# Altium project Dragonflyte.PrjPcb (part 2 of 2)

## Sheet USB.SchDoc
size A; DocumentNumber: 8; SheetNumber: 8
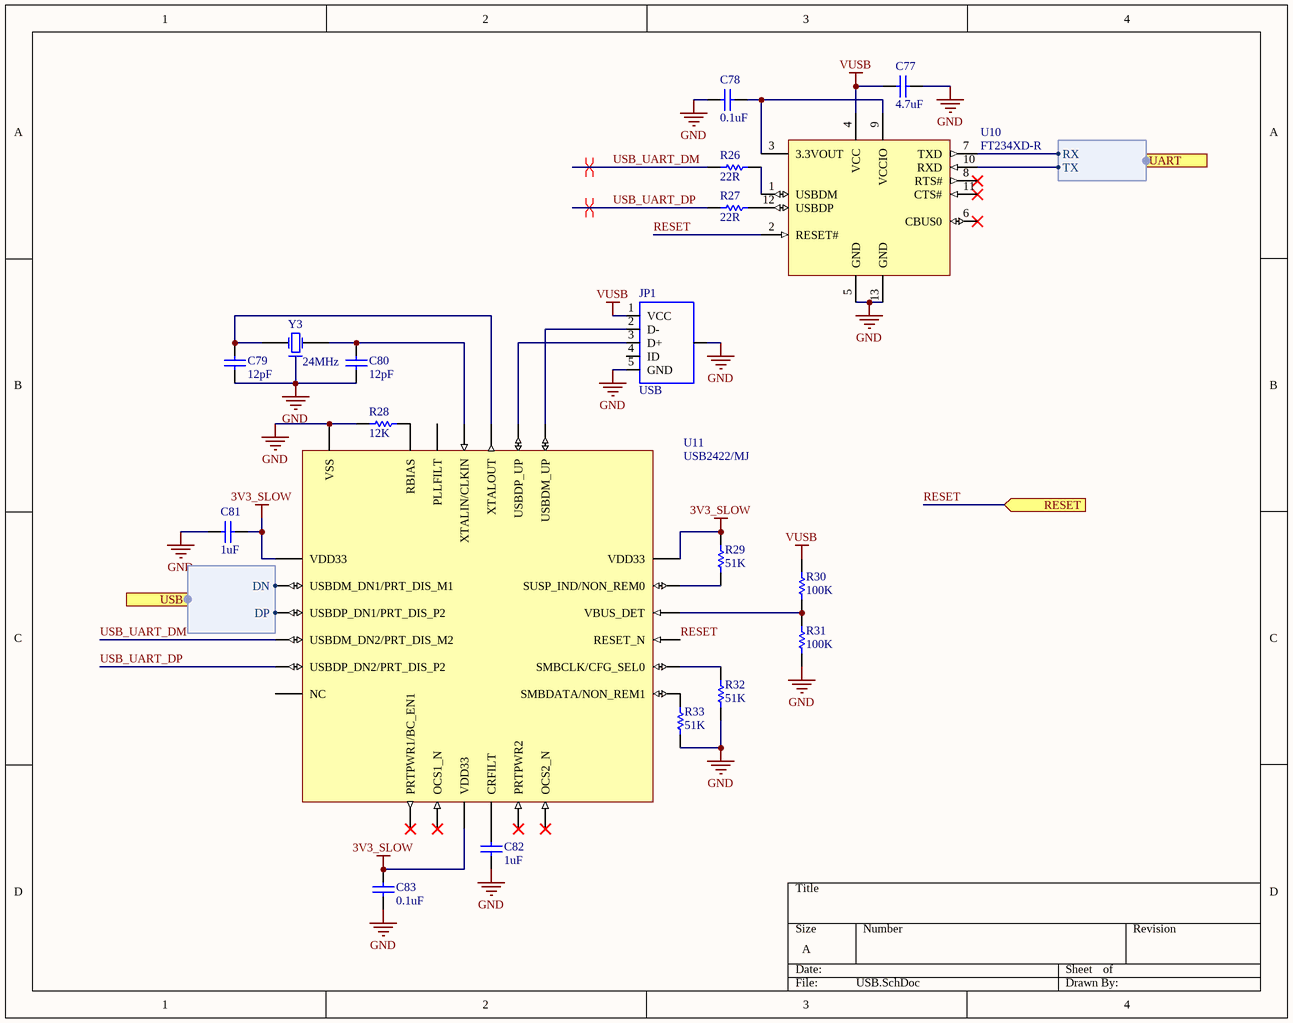
[diagram p6: USB.SchDoc]

### Parts
C77  value 4.7uF  [C0402[1005X55]]  (hidden comment: 4.7uF 6.3V 0402)
C78  value 0.1uF  [C0402[1005X55]]  (hidden comment: 0.1uF 6.3V 0402)
C79  value 12pF  [C0402[1005X55]]  (hidden comment: 12pF 50V 0402)
C80  value 12pF  [C0402[1005X55]]  (hidden comment: 12pF 50V 0402)
C81  value 1uF  [C0402[1005X55]]  (hidden comment: 1uF 6.3V 0402)
C82  value 1uF  [C0402[1005X55]]  (hidden comment: 1uF 6.3V 0402)
C83  value 0.1uF  [C0402[1005X55]]  (hidden comment: 0.1uF 6.3V 0402)
JP1  USB  [USB-MICROB]
R26  value 22R  [R0402[1005]]  (hidden comment: 22R 1% 0402)
R27  value 22R  [R0402[1005]]  (hidden comment: 22R 1% 0402)
R28  value 12K  [R0402[1005]]  (hidden comment: 12K 1% 0402)
R29  value 51K  [R0402[1005]]  (hidden comment: 51K 1% 0402)
R30  value 100K  [R0402[1005]]  (hidden comment: 100K 1% 0402)
R31  value 100K  [R0402[1005]]  (hidden comment: 100K 1% 0402)
R32  value 51K  [R0402[1005]]  (hidden comment: 51K 1% 0402)
R33  value 51K  [R0402[1005]]  (hidden comment: 51K 1% 0402)
U10  FT234XD-R  [DFN-12]
U11  USB2422/MJ  [QFN-24 (4x4MM)]
Y3  24MHz  [CRYSTAL_2.0x1.6]

### Ports
RESET (in), UART (harness UART), USB (harness USB)

### Harnesses
USB: DN, DP
UART: TX, RX

### Nets
3V3_SLOW: C81.2 C83.2 R29.2 U11.1(VDD33) U11.9(VDD33) U11.18(VDD33)
GND: C77.2 C78.2 C79.1 C80.1 C81.1 C82.1 C83.1 JP1.5(GND) JP1.6(SHIELD) R28.1 R31.1 R32.1 R33.1 U10.5(GND) U10.13(GND) U11.25(VSS) Y3.2
VUSB: C77.1 JP1.1(VCC) R30.2 U10.4(VCC)
RESET: U10.2(RESET#) U11.15(RESET_N) ; port RESET
UART_USB_RX: U10.7(TXD) ; port UART.RX
UART_USB_TX: U10.10(RXD) ; port UART.TX
USB_OTG_N: U11.2(USBDM_DN1/PRT_DIS_M1) ; port USB.DN
USB_OTG_P: U11.3(USBDP_DN1/PRT_DIS_P2) ; port USB.DP
USB_UART_DM: R26.1 U11.4(USBDM_DN2/PRT_DIS_M2)
USB_UART_DP: R27.1 U11.5(USBDP_DN2/PRT_DIS_P2)
NetC78_1: C78.1 U10.3(3.3VOUT) U10.9(VCCIO)
NetC79_2: C79.2 U11.21(XTALOUT) Y3.1(X1)
NetC80_2: C80.2 U11.22(XTALIN/CLKIN) Y3.3(X2)
NetC82_2: C82.2 U11.10(CRFILT)
NetJP1_2: JP1.2(D-) U11.19(USBDM_UP)
NetJP1_3: JP1.3(D+) U11.20(USBDP_UP)
NetR26_2: R26.2 U10.1(USBDM)
NetR27_2: R27.2 U10.12(USBDP)
NetR28_2: R28.2 U11.24(RBIAS)
NetR29_1: R29.1 U11.17(SUSP_IND/NON_REM0)
NetR30_1: R30.1 R31.2 U11.16(VBUS_DET)
NetR32_2: R32.2 U11.14(SMBCLK/CFG_SEL0)
NetR33_2: R33.2 U11.13(SMBDATA/NON_REM1)

Not connected (* = marked no-connect by the designer): JP1 4(ID); U10 6(CBUS0)* 8(RTS#)* 11(CTS#)*; U11 6(NC) 7(PRTPWR1/BC_EN1)* 8(OCS1_N)* 11(PRTPWR2)* 12(OCS2_N)* 23(PLLFILT)

### Layout directives
differential pair: USB_UART_DM, USB_UART_DP

### Library data of the parts
C77 = CAP_4.7uF_6.3V_0402_20%: as C29 on sheet MPU-Peripherals; Mounting Technology: Surface Mount; PackageReference: 0402; PackageDescription: 0402 (1005 Metric); Voltage: 6.3V; Tolerance: 20%
C78 C83 = CAP_0.1uF_6.3V_0402_10%: as C68 on sheet Supplies; Mounting Technology: Surface Mount; PackageReference: 0402; PackageDescription: 0402 (1005 Metric); Voltage: 6.3V; Tolerance: 10%
C79 C80 = CAP_12pF_50V_0402_5%: 12pF 50V 5% 0402 (1005 Metric); PartNumber: GRM1555C1H120JA01D; Manufacturer: Murata; Mounting Technology: Surface Mount; PackageReference: 0402; PackageDescription: 0402 (1005 Metric); Voltage: 50V; Tolerance: 5%
C81 C82 = CAP_1uF_6.3V_0402_10%: 1uF 6.3V 10% 0402 (1005 Metric); PartNumber: GRM155R70J105KA12D; Manufacturer: Murata; Mounting Technology: Surface Mount; PackageReference: 0402; PackageDescription: 0402 (1005 Metric); Voltage: 6.3V; Tolerance: 10%
JP1 = USB_MICROB_SMT: pin to pad: 1>VBUS 2>D- 3>D+ 4>ID 5>GND 6>MT1+P$1+P$2+MT2; PartNumber: 10118192-0001LF; Manufacturer: Amphenol FCI; Mounting Technology: Surface Mount; PackageReference: USB - Micro B
R26 R27 = RES_22R_0402_1%: 22R 0.063W 1% 0402 (1005 Metric); Manufacturer: KOA Speer; PartNumber: RK73H1ETTP22R0F; Tolerance: 1%; Power: 0.063W; Mounting Technology: Surface Mount; PackageReference: 0402; PackageDescription: 0402 (1005 Metric); ComponentLink1Description: Datasheet; ComponentLink1URL: http://www.koaspeer.com/catimages/Products/RK73H/RK73H.pdf
R28 = RES_12K_0402_1%: 12K 0.063W 1% 0402 (1005 Metric); Manufacturer: KOA Speer; PartNumber: RK73H1ETTP1202F; Tolerance: 1%; Power: 0.063W; Mounting Technology: Surface Mount; PackageReference: 0402; PackageDescription: 0402 (1005 Metric); ComponentLink1Description: Datasheet; ComponentLink1URL: http://www.koaspeer.com/catimages/Products/RK73H/RK73H.pdf
R29 R32 R33 = RES_51K_0402_1%: 51K 0.063W 1% 0402 (1005 Metric); Manufacturer: KOA Speer; PartNumber: RK73H1ETTP5102F; Tolerance: 1%; Power: 0.063W; Mounting Technology: Surface Mount; PackageReference: 0402; PackageDescription: 0402 (1005 Metric); ComponentLink1Description: Datasheet; ComponentLink1URL: http://www.koaspeer.com/catimages/Products/RK73H/RK73H.pdf
R30 R31 = RES_100K_0402_1%: 100K 0.063W 1% 0402 (1005 Metric); Manufacturer: KOA Speer; PartNumber: RK73H1ETTP1003F; Tolerance: 1%; Power: 0.063W; Mounting Technology: Surface Mount; PackageReference: 0402; PackageDescription: 0402 (1005 Metric); ComponentLink1Description: Datasheet; ComponentLink1URL: http://www.koaspeer.com/catimages/Products/RK73H/RK73H.pdf
U10 = FT234XD-R: USB Interface IC USB to Serial UART Interface; Manufacturer: FTDI; PartNumber: FT234XD-R; PackageReference: DFN-12; Mounting Technology: Surface Mount
U11 = USB2422/MJ: USB Hub IC 2-Port; Manufacturer: Microchip; PartNumber: USB2422/MJ; PackageReference: QFN-24; Mounting Technology: Surface Mount
Y3 = FA-128 24.0000MF10Z-W3: Manufacturer: EPSON; PartNumber: FA-128 24.0000MF10Z-W3; Mounting Technology: Surface Mount; PackageReference: 4-SMD

## Sheet Sensors.SchDoc
size A; DocumentNumber: 11; SheetNumber: 11
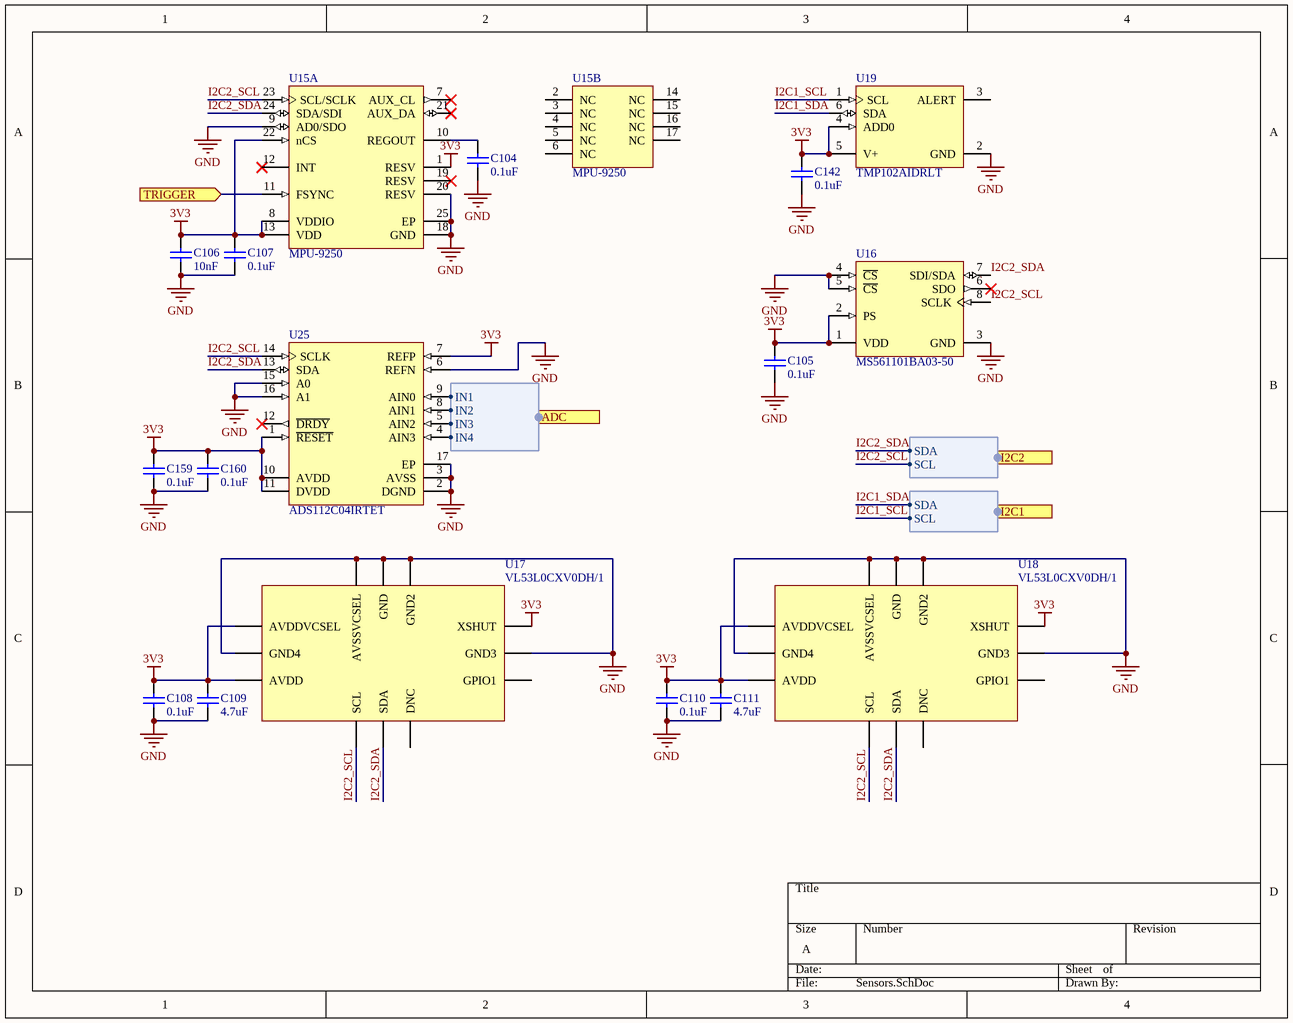
[diagram p7: Sensors.SchDoc]

### Parts
C104  value 0.1uF  [C0402[1005X55]]  (hidden comment: 0.1uF 6.3V 0402)
C105  value 0.1uF  [C0402[1005X55]]  (hidden comment: 0.1uF 6.3V 0402)
C106  value 10nF  [C0402[1005X55]]  (hidden comment: 10nF 50V 0402)
C107  value 0.1uF  [C0402[1005X55]]  (hidden comment: 0.1uF 6.3V 0402)
C108  value 0.1uF  [C0402[1005X55]]  (hidden comment: 0.1uF 6.3V 0402)
C109  value 4.7uF  [C0402[1005X55]]  (hidden comment: 4.7uF 6.3V 0402)
C110  value 0.1uF  [C0402[1005X55]]  (hidden comment: 0.1uF 6.3V 0402)
C111  value 4.7uF  [C0402[1005X55]]  (hidden comment: 4.7uF 6.3V 0402)
C142  value 0.1uF  [C0402[1005X55]]  (hidden comment: 0.1uF 6.3V 0402)
C159  value 0.1uF  [C0402[1005X55]]  (hidden comment: 0.1uF 6.3V 0402)
C160  value 0.1uF  [C0402[1005X55]]  (hidden comment: 0.1uF 6.3V 0402)
U15  MPU-9250  [QFN-24 (0.4MM)]  (parts A,B of 2)
U16  MS561101BA03-50  [QFN-8 (5x3MM)]
U17  VL53L0CXV0DH/1  [LGA-12]
U18  VL53L0CXV0DH/1  [LGA-12]
U19  TMP102AIDRLT  [SOT-563]
U25  ADS112C04IRTET  [QFN-16]

### Ports
ADC (harness ADC), I2C1 (harness I2C), I2C2 (harness I2C), TRIGGER (in)

### Harnesses
I2C: SCL, SDA
ADC: IN3, IN2, IN1, IN4

### Nets
3V3: C105.2 C106.2 C107.2 C108.2 C109.2 C110.2 C111.2 C142.2 C159.2 C160.2 U15.1(RESV) U15.8(VDDIO) U15.13(VDD) U15.22(nCS) U16.1(VDD) U16.2(PS) U17.1(AVDDVCSEL) U17.5(XSHUT) U17.11(AVDD) U18.1(AVDDVCSEL) U18.5(XSHUT) U18.11(AVDD) U19.4(ADD0) U19.5(V+) U25.1(~{RESET}) U25.7(REFP) U25.10(AVDD) U25.11(DVDD)
GND: C104.1 C105.1 C106.1 C107.1 C108.1 C109.1 C110.1 C111.1 C142.1 C159.1 C160.1 U15.9(AD0/SDO) U15.18(GND) U15.20(RESV) U15.25(EP) U16.3(GND) U16.4(~{CS}) U16.5(~{CS}) U17.2(AVSSVCSEL) U17.3(GND) U17.4(GND2) U17.6(GND3) U17.12(GND4) U18.2(AVSSVCSEL) U18.3(GND) U18.4(GND2) U18.6(GND3) U18.12(GND4) U19.2(GND) U25.2(DGND) U25.3(AVSS) U25.6(REFN) U25.15(A0) U25.16(A1) U25.17(EP)
I2C1_SCL: U19.1(SCL) ; port I2C1.SCL
I2C1_SDA: U19.6(SDA) ; port I2C1.SDA
I2C2_SCL: U15.23(SCL/SCLK) U16.8(SCLK) U17.10(SCL) U18.10(SCL) U25.14(SCLK) ; port I2C2.SCL
I2C2_SDA: U15.24(SDA/SDI) U16.7(SDI/SDA) U17.9(SDA) U18.9(SDA) U25.13(SDA) ; port I2C2.SDA
TRIGGER: U15.11(FSYNC) ; port TRIGGER
NetC104_2: C104.2 U15.10(REGOUT)
NetJP3_2: U25.4(AIN3) ; port ADC.IN4
NetJP3_3: U25.5(AIN2) ; port ADC.IN3
NetJP3_4: U25.8(AIN1) ; port ADC.IN2
NetJP3_5: U25.9(AIN0) ; port ADC.IN1

Not connected (* = marked no-connect by the designer): U15 2(NC) 3(NC) 4(NC) 5(NC) 6(NC) 7(AUX_CL)* 12(INT)* 14(NC) 15(NC) 16(NC) 17(NC) 19(RESV)* 21(AUX_DA)*; U16 6(SDO)*; U17 7(GPIO1) 8(DNC); U18 7(GPIO1) 8(DNC); U19 3(ALERT); U25 12(~{DRDY})*

### Library data of the parts
C104 C105 C107 C108 C110 C142 C159 C160 = CAP_0.1uF_6.3V_0402_10%: as C68 on sheet Supplies; Mounting Technology: Surface Mount; PackageReference: 0402; PackageDescription: 0402 (1005 Metric); Voltage: 6.3V; Tolerance: 10%
C106 = CAP_10nF_50V_0402_10%: 10nF 50V 10% 0402 (1005 Metric); PartNumber: GCM155R71H103KA55D; Manufacturer: Murata; Mounting Technology: Surface Mount; PackageReference: 0402; PackageDescription: 0402 (1005 Metric); Voltage: 50V; Tolerance: 10%
C109 C111 = CAP_4.7uF_6.3V_0402_20%: as C29 on sheet MPU-Peripherals; Mounting Technology: Surface Mount; PackageReference: 0402; PackageDescription: 0402 (1005 Metric); Voltage: 6.3V; Tolerance: 20%
U15 = MPU-9250: Manufacturer: Invensense; PartNumber: MPU-9250; Mounting Technology: Surface Mount; PackageReference: QFN-24
U16 = MS561101BA03-50: BAROMETRIC PRESSURE SENSOR; Manufacturer: TE Connectivity Measurement Specialties; PartNumber: MS561101BA03-50; PackageReference: 8-SMD; Mounting Technology: Surface Mount
U17 U18 = VL53L0CXV0DH/1: Optical Sensor Modules Time-of-Flight (ToF) ranging sensor; Manufacturer: STMicroelectronics; PartNumber: VL53L0CXV0DH/1; Mounting Technology: Surface Mount; PackageReference: LGA-12
U19 = TMP102AIDRLT: SENSOR DIGITAL -40C-125C SOT563; Manufacturer: Texas Instruments; PackageReference: SOT-563; PartNumber: TMP102AIDRLT; Mounting Technology: Surface Mount
U25 = ADS112C04IRTET: IC ADC 16BIT I2C 1KSPS 16WQFN; Manufacturer: Texas Instruments; PackageReference: QFN-16; Mounting Technology: Surface Mount; PartNumber: ADS112C04IRTET

## Sheet UWB.SchDoc
size A; DocumentNumber: 10; SheetNumber: 10
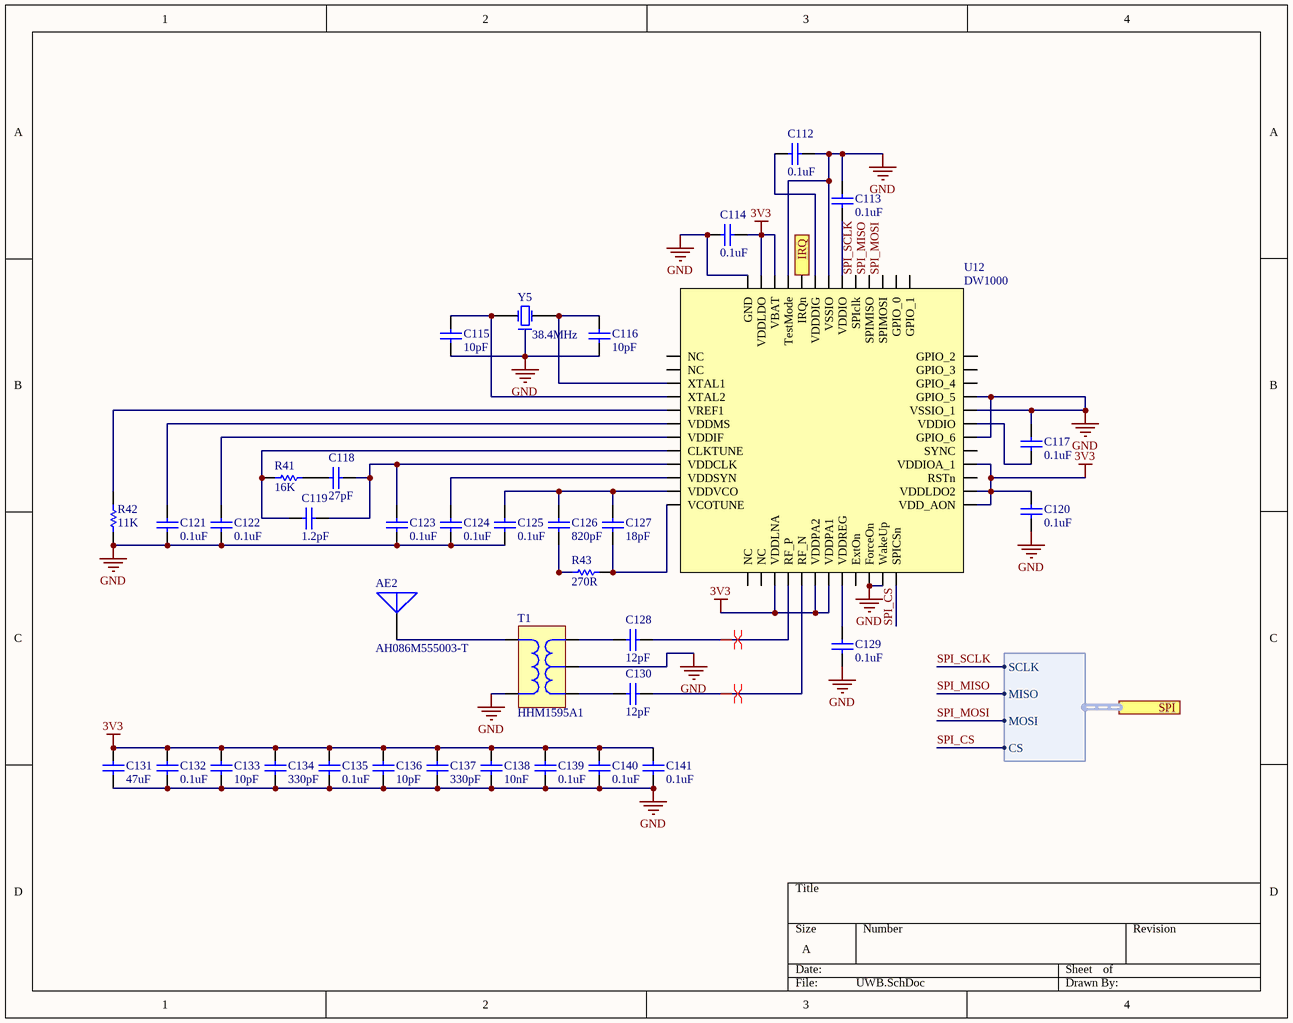
[diagram p8: UWB.SchDoc]

### Parts
AE2  AH086M555003-T  [AH086M555003-T]
C112  value 0.1uF  [C0402[1005X55]]  (hidden comment: 0.1uF 6.3V 0402)
C113  value 0.1uF  [C0402[1005X55]]  (hidden comment: 0.1uF 6.3V 0402)
C114  value 0.1uF  [C0402[1005X55]]  (hidden comment: 0.1uF 6.3V 0402)
C115  value 10pF  [C0402[1005X55]]  (hidden comment: 10pF 50V 0402)
C116  value 10pF  [C0402[1005X55]]  (hidden comment: 10pF 50V 0402)
C117  value 0.1uF  [C0402[1005X55]]  (hidden comment: 0.1uF 6.3V 0402)
C118  value 27pF  [C0402[1005X55]]  (hidden comment: 27pF 50V 0402)
C119  value 1.2pF  [C0402[1005X55]]  (hidden comment: 1.2pF 50V 0402)
C120  value 0.1uF  [C0402[1005X55]]  (hidden comment: 0.1uF 6.3V 0402)
C121  value 0.1uF  [C0402[1005X55]]  (hidden comment: 0.1uF 6.3V 0402)
C122  value 0.1uF  [C0402[1005X55]]  (hidden comment: 0.1uF 6.3V 0402)
C123  value 0.1uF  [C0402[1005X55]]  (hidden comment: 0.1uF 6.3V 0402)
C124  value 0.1uF  [C0402[1005X55]]  (hidden comment: 0.1uF 6.3V 0402)
C125  value 0.1uF  [C0402[1005X55]]  (hidden comment: 0.1uF 6.3V 0402)
C126  value 820pF  [C0402[1005X55]]  (hidden comment: 820pF 50V 0402)
C127  value 18pF  [C0402[1005X55]]  (hidden comment: 18pF 50V 0402)
C128  value 12pF  [C0402[1005X55]]  (hidden comment: 12pF 50V 0402)
C129  value 0.1uF  [C0402[1005X55]]  (hidden comment: 0.1uF 6.3V 0402)
C130  value 12pF  [C0402[1005X55]]  (hidden comment: 12pF 50V 0402)
C131  value 47uF  [C1206[3216X160]]  (hidden comment: 47uF 6.3V 1206)
C132  value 0.1uF  [C0402[1005X55]]  (hidden comment: 0.1uF 6.3V 0402)
C133  value 10pF  [C0402[1005X55]]  (hidden comment: 10pF 50V 0402)
C134  value 330pF  [C0402[1005X55]]  (hidden comment: 330pF 50V 0402)
C135  value 0.1uF  [C0402[1005X55]]  (hidden comment: 0.1uF 6.3V 0402)
C136  value 10pF  [C0402[1005X55]]  (hidden comment: 10pF 50V 0402)
C137  value 330pF  [C0402[1005X55]]  (hidden comment: 330pF 50V 0402)
C138  value 10nF  [C0402[1005X55]]  (hidden comment: 10nF 50V 0402)
C139  value 0.1uF  [C0402[1005X55]]  (hidden comment: 0.1uF 6.3V 0402)
C140  value 0.1uF  [C0402[1005X55]]  (hidden comment: 0.1uF 6.3V 0402)
C141  value 0.1uF  [C0402[1005X55]]  (hidden comment: 0.1uF 6.3V 0402)
R41  value 16K  [R0402[1005]]  (hidden comment: 16K 1% 0402)
R42  value 11K  [R0402[1005]]  (hidden comment: 11K 1% 0402)
R43  value 270R  [R0402[1005]]  (hidden comment: 270R 1% 0402)
T1  HHM1595A1  [HHM1595A1]
U12  DW1000  [QFN-48]
Y5  38.4MHz  [ABRA-ABM10]

### Ports
IRQ (out), SPI (harness SPI)

### Harnesses
SPI: SCLK, MISO, MOSI, CS

### Nets
3V3: C114.1 C120.2 C131.2 C132.2 C133.2 C134.2 C135.2 C136.2 C137.2 C138.2 C139.2 C140.2 C141.2 U12.15(VDDLNA) U12.18(VDDPA2) U12.19(VDDPA1) U12.25(VDD_AON) U12.26(VDDLDO2) U12.28(VDDIOA_1) U12.47(VBAT) U12.48(VDDLDO)
GND: C112.1 C113.2 C114.2 C115.1 C116.1 C117.2 C120.1 C121.1 C122.1 C123.1 C124.1 C125.1 C129.1 C131.1 C132.1 C133.1 C134.1 C135.1 C136.1 C137.1 C138.1 C139.1 C140.1 C141.1 R42.1 T1.2 T1.5 U12.22(ForceOn) U12.23(WakeUp) U12.30(GPIO_6) U12.32(VSSIO_1) U12.33(GPIO_5) U12.43(VSSIO) U12.46(TestMode) U12.49(GND) Y5.2
SPI_CS: U12.24(SPICSn) ; port SPI.CS
SPI_MISO: U12.40(SPIMISO) ; port SPI.MISO
SPI_MOSI: U12.39(SPIMOSI) ; port SPI.MOSI
SPI_SCLK: U12.41(SPIclk) ; port SPI.SCLK
NetAE2_1: AE2.1 T1.1
NetC112_2: C112.2 U12.44(VDDDIG)
NetC113_1: C113.1 U12.42(VDDIO)
NetC115_2: C115.2 U12.4(XTAL2) Y5.1(X1)
NetC116_2: C116.2 U12.3(XTAL1) Y5.3(X2)
NetC117_1: C117.1 U12.31(VDDIO)
NetC118_1: C118.1 C119.1 C123.2 U12.9(VDDCLK)
NetC118_2: C118.2 R41.1
NetC119_2: C119.2 R41.2 U12.8(CLKTUNE)
NetC121_2: C121.2 U12.6(VDDMS)
NetC122_2: C122.2 U12.7(VDDIF)
NetC124_2: C124.2 U12.10(VDDSYN)
NetC125_2: C125.2 C126.2 C127.2 U12.11(VDDVCO)
NetC126_1: C126.1 R43.1
NetC127_1: C127.1 R43.2 U12.12(VCOTUNE)
NetC128_1: C128.1 T1.4
NetC128_2: C128.2 U12.16(RF_P)
NetC129_2: C129.2 U12.20(VDDREG)
NetC130_1: C130.1 T1.3
NetC130_2: C130.2 U12.17(RF_N)
NetR42_2: R42.2 U12.5(VREF1)
NetU1_A16: U12.45(IRQn) ; port IRQ

Not connected (* = marked no-connect by the designer): U12 1(NC) 2(NC) 13(NC) 14(NC) 21(ExtOn) 27(RSTn) 29(SYNC) 34(GPIO_4) 35(GPIO_3) 36(GPIO_2) 37(GPIO_1) 38(GPIO_0)

### Layout directives
differential pair: NetC128_2, NetC130_2

### Library data of the parts
AE2 = AH086M555003-T: Manufacturer: Taiyo Yuden; PartNumber: AH086M555003-T; Mounting Technology: Surface Mount
C112-C114 C117 C120-C125 C129 C132 C135 C139-C141 = CAP_0.1uF_6.3V_0402_10%: as C68 on sheet Supplies; Mounting Technology: Surface Mount; PackageReference: 0402; PackageDescription: 0402 (1005 Metric); Voltage: 6.3V; Tolerance: 10%
C115 C116 C133 C136 = CAP_10pF_50V_0402_1%: 10pF 50V 1% 0402 (1005 Metric); PartNumber: GRM1555C1H100FA01D; Manufacturer: Murata; Mounting Technology: Surface Mount; PackageReference: 0402; PackageDescription: 0402 (1005 Metric); Voltage: 50V; Tolerance: 1%
C118 = CAP_27pF_50V_0402_1%: 27pF 50V 1% 0402 (1005 Metric); PartNumber: GRM1555C1H270FA01D; Manufacturer: Murata; Mounting Technology: Surface Mount; PackageReference: 0402; PackageDescription: 0402 (1005 Metric); Voltage: 50V; Tolerance: 1%
C119 = CAP_1.2pF_50V_0402_0.05pF: 1.2pF 50V 0.05pF 0402 (1005 Metric); PartNumber: GRM1555C1H1R2WA01D; Manufacturer: Murata; Mounting Technology: Surface Mount; PackageReference: 0402; PackageDescription: 0402 (1005 Metric); Voltage: 50V; Tolerance: 0.05pF
C126 = CAP_820pF_50V_0402_5%: 820pF 50V 5% 0402 (1005 Metric); PartNumber: GRM1555C1H821JA01D; Manufacturer: Murata; Mounting Technology: Surface Mount; PackageReference: 0402; PackageDescription: 0402 (1005 Metric); Voltage: 50V; Tolerance: 5%
C127 = CAP_18pF_50V_0402_1%: 18pF 50V 1% 0402 (1005 Metric); PartNumber: GRM1555C1H180FA01D; Manufacturer: Murata; Mounting Technology: Surface Mount; PackageReference: 0402; PackageDescription: 0402 (1005 Metric); Voltage: 50V; Tolerance: 1%
C128 C130 = CAP_12pF_50V_0402_5%: as C79 on sheet USB; Mounting Technology: Surface Mount; PackageReference: 0402; PackageDescription: 0402 (1005 Metric); Voltage: 50V; Tolerance: 5%
C131 = CAP_47uF_6.3V_1206_10%: 47uF 6.3V 10% 1206 (3216 Metric); PartNumber: GRM31CR60J476KE19L; Manufacturer: Murata; Mounting Technology: Surface Mount; PackageReference: 1206; PackageDescription: 1206 (3216 Metric); Voltage: 6.3V; Tolerance: 10%
C134 C137 = CAP_330pF_50V_0402_5%: 330pF 50V 5% 0402 (1005 Metric); PartNumber: GRM1555C1H331JA01D; Manufacturer: Murata; Mounting Technology: Surface Mount; PackageReference: 0402; PackageDescription: 0402 (1005 Metric); Voltage: 50V; Tolerance: 5%
C138 = CAP_10nF_50V_0402_10%: as C106 on sheet Sensors; Mounting Technology: Surface Mount; PackageReference: 0402; PackageDescription: 0402 (1005 Metric); Voltage: 50V; Tolerance: 10%
R41 = RES_16K_0402_1%: 16K 0.063W 1% 0402 (1005 Metric); Manufacturer: KOA Speer; PartNumber: RK73H1ETTP1602F; Tolerance: 1%; Power: 0.063W; Mounting Technology: Surface Mount; PackageReference: 0402; PackageDescription: 0402 (1005 Metric); ComponentLink1Description: Datasheet; ComponentLink1URL: http://www.koaspeer.com/catimages/Products/RK73H/RK73H.pdf
R42 = RES_11K_0402_1%: 11K 0.063W 1% 0402 (1005 Metric); Manufacturer: KOA Speer; PartNumber: RK73H1ETTP1102F; Tolerance: 1%; Power: 0.063W; Mounting Technology: Surface Mount; PackageReference: 0402; PackageDescription: 0402 (1005 Metric); ComponentLink1Description: Datasheet; ComponentLink1URL: http://www.koaspeer.com/catimages/Products/RK73H/RK73H.pdf
R43 = RES_270R_0402_1%: 270R 0.063W 1% 0402 (1005 Metric); Manufacturer: KOA Speer; PartNumber: RK73H1ETTP2700F; Tolerance: 1%; Power: 0.063W; Mounting Technology: Surface Mount; PackageReference: 0402; PackageDescription: 0402 (1005 Metric); ComponentLink1Description: Datasheet; ComponentLink1URL: http://www.koaspeer.com/catimages/Products/RK73H/RK73H.pdf
T1 = HHM1595A1: Manufacturer: TDK; PartNumber: HHM1595A1; PackageReference: 0805; Mounting Technology: Surface Mount
U12 = DW1000: UWB DW1000; PartNumber: DW1000-I-TR13; Manufacturer: Decawave Limited; PackageReference: QFN-48; Mounting Technology: Surface Mount
Y5 = ABM10-165-38.400MHZ-T3: Manufacturer: ABRACON; PartNumber: ABM10-165-38.400MHZ-T3; Mounting Technology: Surface Mount; PackageReference: 4-SMD; PackageDescription: 4-SMD, No Lead (DFN, LCC)

## Sheet MicrophoneArray.SchDoc
size A; DocumentNumber: 13; SheetNumber: 13
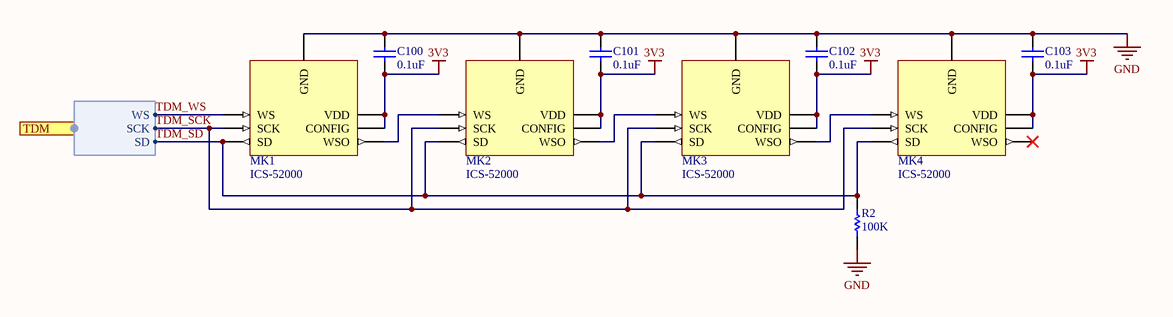
[diagram p9: MicrophoneArray.SchDoc]

### Parts
C100  value 0.1uF  [C0402[1005X55]]  (hidden comment: 0.1uF 6.3V 0402)
C101  value 0.1uF  [C0402[1005X55]]  (hidden comment: 0.1uF 6.3V 0402)
C102  value 0.1uF  [C0402[1005X55]]  (hidden comment: 0.1uF 6.3V 0402)
C103  value 0.1uF  [C0402[1005X55]]  (hidden comment: 0.1uF 6.3V 0402)
MK1  ICS-52000  [MIC]
MK2  ICS-52000  [MIC]
MK3  ICS-52000  [MIC]
MK4  ICS-52000  [MIC]
R2  value 100K  [R0402[1005]]  (hidden comment: 100K 1% 0402)

### Ports
TDM (harness TDM)

### Harnesses
TDM: WS, SCK, SD

### Nets
3V3: C100.1 C101.1 C102.1 C103.1 MK1.2(CONFIG) MK1.3(VDD) MK2.2(CONFIG) MK2.3(VDD) MK3.2(CONFIG) MK3.3(VDD) MK4.2(CONFIG) MK4.3(VDD)
GND: C100.2 C101.2 C102.2 C103.2 MK1.4(GND) MK2.4(GND) MK3.4(GND) MK4.4(GND) R2.1
TDM_SCK: MK1.6(SCK) MK2.6(SCK) MK3.6(SCK) MK4.6(SCK) ; port TDM.SCK
TDM_SD: MK1.7(SD) MK2.7(SD) MK3.7(SD) MK4.7(SD) R2.2 ; port TDM.SD
TDM_WS: MK1.5(WS) ; port TDM.WS
NetMK1_1: MK1.1(WSO) MK2.5(WS)
NetMK2_1: MK2.1(WSO) MK3.5(WS)
NetMK3_1: MK3.1(WSO) MK4.5(WS)

Not connected (* = marked no-connect by the designer): MK4 1(WSO)*

### Library data of the parts
C100-C103 = CAP_0.1uF_6.3V_0402_10%: as C68 on sheet Supplies; Mounting Technology: Surface Mount; PackageReference: 0402; PackageDescription: 0402 (1005 Metric); Voltage: 6.3V; Tolerance: 10%
MK1-MK4 = ICS-52000: MIC MEMS DIGITAL OMNI -26DB; Manufacturer: TDK InvenSense; PartNumber: ICS-52000; Mounting Technology: Surface Mount
R2 = RES_100K_0402_1%: as R30 on sheet USB; Tolerance: 1%; Power: 0.063W; Mounting Technology: Surface Mount; PackageReference: 0402; PackageDescription: 0402 (1005 Metric); ComponentLink1Description: Datasheet; ComponentLink1URL: http://www.koaspeer.com/catimages/Products/RK73H/RK73H.pdf

## Sheet Cameras.SchDoc
size B; DocumentNumber: 9; SheetNumber: 9
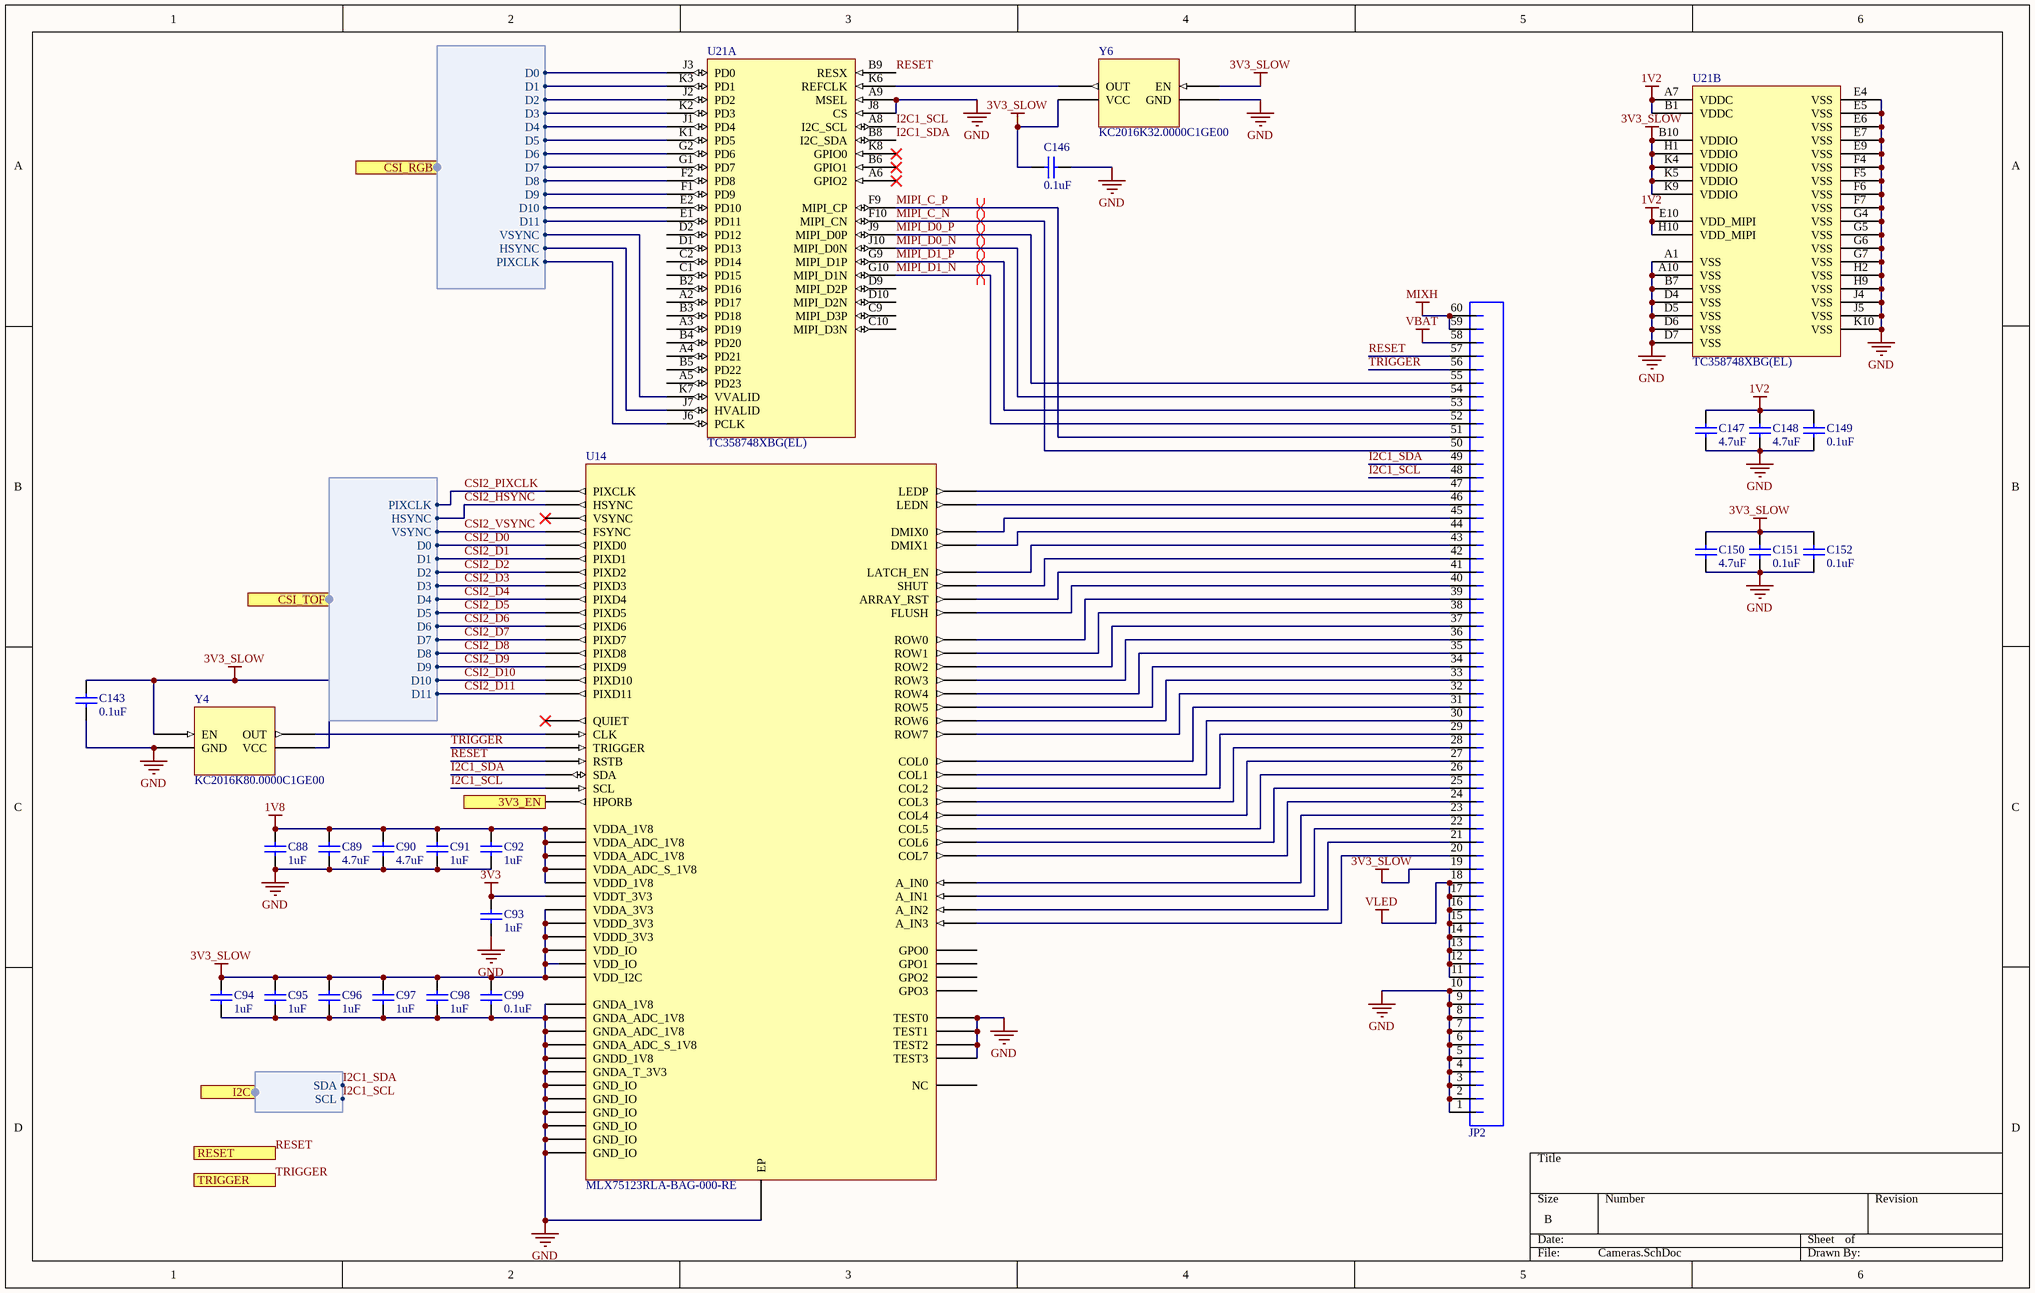
[diagram p10: Cameras.SchDoc]

### Parts
C88  value 1uF  [C0402[1005X55]]  (hidden comment: 1uF 6.3V 0402)
C89  value 4.7uF  [C0402[1005X55]]  (hidden comment: 4.7uF 6.3V 0402)
C90  value 4.7uF  [C0402[1005X55]]  (hidden comment: 4.7uF 6.3V 0402)
C91  value 1uF  [C0402[1005X55]]  (hidden comment: 1uF 6.3V 0402)
C92  value 1uF  [C0402[1005X55]]  (hidden comment: 1uF 6.3V 0402)
C93  value 1uF  [C0402[1005X55]]  (hidden comment: 1uF 6.3V 0402)
C94  value 1uF  [C0402[1005X55]]  (hidden comment: 1uF 6.3V 0402)
C95  value 1uF  [C0402[1005X55]]  (hidden comment: 1uF 6.3V 0402)
C96  value 1uF  [C0402[1005X55]]  (hidden comment: 1uF 6.3V 0402)
C97  value 1uF  [C0402[1005X55]]  (hidden comment: 1uF 6.3V 0402)
C98  value 1uF  [C0402[1005X55]]  (hidden comment: 1uF 6.3V 0402)
C99  value 0.1uF  [C0402[1005X55]]  (hidden comment: 0.1uF 6.3V 0402)
C143  value 0.1uF  [C0402[1005X55]]  (hidden comment: 0.1uF 6.3V 0402)
C146  value 0.1uF  [C0402[1005X55]]  (hidden comment: 0.1uF 6.3V 0402)
C147  value 4.7uF  [C0402[1005X55]]  (hidden comment: 4.7uF 6.3V 0402)
C148  value 4.7uF  [C0402[1005X55]]  (hidden comment: 4.7uF 6.3V 0402)
C149  value 0.1uF  [C0402[1005X55]]  (hidden comment: 0.1uF 6.3V 0402)
C150  value 4.7uF  [C0402[1005X55]]  (hidden comment: 4.7uF 6.3V 0402)
C151  value 0.1uF  [C0402[1005X55]]  (hidden comment: 0.1uF 6.3V 0402)
C152  value 0.1uF  [C0402[1005X55]]  (hidden comment: 0.1uF 6.3V 0402)
JP2  JST_JMD_60_HORZ  [JST-JMD-60-SMD-HORZ]  (value not drawn)
U14  MLX75123RLA-BAG-000-RE  [AQFN-84]
U21  TC358748XBG(EL)  [BGA-80]  (parts A,B of 2)
Y4  KC2016K80.0000C1GE00  [KC2016K]
Y6  KC2016K32.0000C1GE00  [KC2016K]

### Ports
3V3_EN (out), CSI_RGB (harness CSI12), CSI_TOF (harness CSI12), I2C (harness I2C), RESET (in), TRIGGER (in)

### Harnesses
CSI12: D2, D3, D1, D0, D6, D7, D5, D4, D10, D9, D8, PIXCLK, D11, HSYNC, VSYNC
I2C: SCL, SDA

### Nets
1V2: C147.2 C148.2 C149.2 U21.A7(VDDC) U21.B1(VDDC) U21.E10(VDD_MIPI) U21.H10(VDD_MIPI)
1V8: C88.2 C89.2 C90.2 C91.2 C92.2 U14.A9(VDDA_ADC_1V8) U14.A10(VDDA_ADC_S_1V8) U14.B5(VDDA_ADC_1V8) U14.B14(VDDA_1V8) U14.B20(VDDD_1V8)
3V3: C93.2 U14.B17(VDDT_3V3)
3V3_SLOW: C94.2 C95.2 C96.2 C97.2 C98.2 C99.2 C143.2 C146.1 C150.2 C151.2 C152.2 JP2.19 U14.A36(VDDD_3V3) U14.B4(VDDA_3V3) U14.B12(VDD_I2C) U14.B21(VDD_IO) U14.B30(VDD_IO) U14.B38(VDDD_3V3) U21.B10(VDDIO) U21.H1(VDDIO) U21.K4(VDDIO) U21.K5(VDDIO) U21.K9(VDDIO) Y4.1(EN) Y4.4(VCC) Y6.1(EN) Y6.4(VCC)
GND: C88.1 C89.1 C90.1 C91.1 C92.1 C93.1 C94.1 C95.1 C96.1 C97.1 C98.1 C99.1 C143.1 C146.2 C147.1 C148.1 C149.1 C150.1 C151.1 C152.1 JP2.1 JP2.2 JP2.3 JP2.4 JP2.5 JP2.6 JP2.7 JP2.8 JP2.9 JP2.10 U14.A5(GNDA_ADC_1V8) U14.A8(GND_IO) U14.A11(TEST2) U14.A16(GNDA_1V8) U14.A17(TEST0) U14.A18(GNDA_T_3V3) U14.A22(GNDD_1V8) U14.A24(GND_IO) U14.A33(GND_IO) U14.A41(GND_IO) U14.B8(GNDA_ADC_1V8) U14.B9(GNDA_ADC_S_1V8) U14.B10(TEST3) U14.B15(GND_IO) U14.B16(TEST1) U14.B33(GND_IO) U14.EP U21.A1(VSS) U21.A9(MSEL) U21.A10(VSS) U21.B7(VSS) U21.D4(VSS) U21.D5(VSS) U21.D6(VSS) U21.D7(VSS) U21.E4(VSS) U21.E5(VSS) U21.E6(VSS) U21.E7(VSS) U21.E9(VSS) U21.F4(VSS) U21.F5(VSS) U21.F6(VSS) U21.F7(VSS) U21.G4(VSS) U21.G5(VSS) U21.G6(VSS) U21.G7(VSS) U21.H2(VSS) U21.H9(VSS) U21.J4(VSS) U21.J5(VSS) U21.J8(CS) U21.K10(VSS) Y4.2(GND) Y6.2(GND)
MIXH: JP2.59 JP2.60
VBAT: JP2.58
VLED: JP2.11 JP2.12 JP2.13 JP2.14 JP2.15 JP2.16 JP2.17 JP2.18
CSI1_D0: U21.J3(PD0) ; port CSI_RGB.D0
CSI1_D1: U21.K3(PD1) ; port CSI_RGB.D1
CSI1_D2: U21.J2(PD2) ; port CSI_RGB.D2
CSI1_D3: U21.K2(PD3) ; port CSI_RGB.D3
CSI1_D4: U21.J1(PD4) ; port CSI_RGB.D4
CSI1_D5: U21.K1(PD5) ; port CSI_RGB.D5
CSI1_D6: U21.G2(PD6) ; port CSI_RGB.D6
CSI1_D7: U21.G1(PD7) ; port CSI_RGB.D7
CSI1_D8: U21.F2(PD8) ; port CSI_RGB.D8
CSI1_D9: U21.F1(PD9) ; port CSI_RGB.D9
CSI1_D10: U21.E2(PD10) ; port CSI_RGB.D10
CSI1_D11: U21.E1(PD11) ; port CSI_RGB.D11
CSI1_HSYNC: U21.J7(HVALID) ; port CSI_RGB.HSYNC
CSI1_PIXCLK: U21.K7(VVALID) ; port CSI_RGB.VSYNC
CSI1_VSYNC: U21.J6(PCLK) ; port CSI_RGB.PIXCLK
CSI2_D0: U14.A30(PIXD0) ; port CSI_TOF.D0
CSI2_D1: U14.B27(PIXD1) ; port CSI_TOF.D1
CSI2_D2: U14.A29(PIXD2) ; port CSI_TOF.D2
CSI2_D3: U14.B26(PIXD3) ; port CSI_TOF.D3
CSI2_D4: U14.A28(PIXD4) ; port CSI_TOF.D4
CSI2_D5: U14.B25(PIXD5) ; port CSI_TOF.D5
CSI2_D6: U14.A27(PIXD6) ; port CSI_TOF.D6
CSI2_D7: U14.B24(PIXD7) ; port CSI_TOF.D7
CSI2_D8: U14.A26(PIXD8) ; port CSI_TOF.D8
CSI2_D9: U14.B23(PIXD9) ; port CSI_TOF.D9
CSI2_D10: U14.A25(PIXD10) ; port CSI_TOF.D10
CSI2_D11: U14.B22(PIXD11) ; port CSI_TOF.D11
CSI2_HSYNC: U14.B29(HSYNC) ; port CSI_TOF.HSYNC
CSI2_PIXCLK: U14.B28(PIXCLK) ; port CSI_TOF.PIXCLK
CSI2_VSYNC: U14.A31(FSYNC) ; port CSI_TOF.VSYNC
I2C1_SCL: JP2.48 U14.A12(SCL) U21.A8(I2C_SCL) ; port I2C.SCL
I2C1_SDA: JP2.49 U14.B11(SDA) U21.B8(I2C_SDA) ; port I2C.SDA
MIPI_C_N: JP2.50 U21.F10(MIPI_CN)
MIPI_C_P: JP2.51 U21.F9(MIPI_CP)
MIPI_D0_N: JP2.54 U21.J10(MIPI_D0N)
MIPI_D0_P: JP2.55 U21.J9(MIPI_D0P)
MIPI_D1_N: JP2.52 U21.G10(MIPI_D1N)
MIPI_D1_P: JP2.53 U21.G9(MIPI_D1P)
RESET: JP2.57 U14.A14(RSTB) U21.B9(RESX) ; port RESET
TRIGGER: JP2.56 U14.A13(TRIGGER) ; port TRIGGER
NetJP2_20: JP2.20 U14.B7(A_IN3)
NetJP2_21: JP2.21 U14.A7(A_IN2)
NetJP2_22: JP2.22 U14.A6(A_IN1)
NetJP2_23: JP2.23 U14.B6(A_IN0)
NetJP2_24: JP2.24 U14.A37(COL7)
NetJP2_25: JP2.25 U14.B34(COL6)
NetJP2_26: JP2.26 U14.A38(COL5)
NetJP2_27: JP2.27 U14.B35(COL4)
NetJP2_28: JP2.28 U14.A39(COL3)
NetJP2_29: JP2.29 U14.B36(COL2)
NetJP2_30: JP2.30 U14.A40(COL1)
NetJP2_31: JP2.31 U14.B37(COL0)
NetJP2_32: JP2.32 U14.A2(ROW7)
NetJP2_33: JP2.33 U14.B1(ROW6)
NetJP2_34: JP2.34 U14.A1(ROW5)
NetJP2_35: JP2.35 U14.A44(ROW4)
NetJP2_36: JP2.36 U14.B40(ROW3)
NetJP2_37: JP2.37 U14.A43(ROW2)
NetJP2_38: JP2.38 U14.B39(ROW1)
NetJP2_39: JP2.39 U14.A42(ROW0)
NetJP2_40: JP2.40 U14.B3(FLUSH)
NetJP2_41: JP2.41 U14.A3(ARRAY_RST)
NetJP2_42: JP2.42 U14.B2(SHUT)
NetJP2_43: JP2.43 U14.A4(LATCH_EN)
NetJP2_44: JP2.44 U14.B32(DMIX1)
NetJP2_45: JP2.45 U14.A35(DMIX0)
NetJP2_46: JP2.46 U14.A34(LEDN)
NetJP2_47: JP2.47 U14.B31(LEDP)
NetU7_9: U14.A19(HPORB) ; port 3V3_EN
NetU14_B13: U14.B13(CLK) Y4.3(OUT)
NetU21_K6: U21.K6(REFCLK) Y6.3(OUT)

Not connected (* = marked no-connect by the designer): U14 A15(QUIET)* A20(GPO1) A21(GPO3) A23(NC) A32(VSYNC)* B18(GPO0) B19(GPO2); U21 A2(PD17) A3(PD19) A4(PD21) A5(PD23) A6(GPIO2)* B2(PD16) B3(PD18) B4(PD20) B5(PD22) B6(GPIO1)* C1(PD15) C2(PD14) C9(MIPI_D3P) C10(MIPI_D3N) D1(PD13) D2(PD12) D9(MIPI_D2P) D10(MIPI_D2N) K8(GPIO0)*

### Layout directives
differential pair; differential pair class USB2: MIPI_C_N, MIPI_C_P, MIPI_D0_N, MIPI_D0_P, MIPI_D1_N, MIPI_D1_P

### Library data of the parts
C88 C91-C98 = CAP_1uF_6.3V_0402_10%: 1uF 6.3V 10% 0402 (1005 Metric); PartNumber: GRM155R70J105KA12D; Manufacturer: Murata; Mounting Technology: Surface Mount; PackageReference: 0402; PackageDescription: 0402 (1005 Metric); Voltage: 6.3V; Tolerance: 10%
C89 C90 C147 C148 C150 = CAP_4.7uF_6.3V_0402_20%: 4.7uF 6.3V 20% 0402 (1005 Metric); PartNumber: GRM155R60J475ME47D; Manufacturer: Murata; Mounting Technology: Surface Mount; PackageReference: 0402; PackageDescription: 0402 (1005 Metric); Voltage: 6.3V; Tolerance: 20%
C99 C143 C146 C149 C151 C152 = CAP_0.1uF_6.3V_0402_10%: 0.1uF 6.3V 10% 0402 (1005 Metric); PartNumber: GRM155R70J104KA01D; Manufacturer: Murata; Mounting Technology: Surface Mount; PackageReference: 0402; PackageDescription: 0402 (1005 Metric); Voltage: 6.3V; Tolerance: 10%
JP2 = JST_JMD_60_HORZ: Manufacturer: JST Sales America, Inc.; PartNumber: 60PS-JMDSS-G-1-TF; PackageReference: JMD-60; Mounting Technology: Surface Mount
U14 = MLX75123RLA-BAG-000-RE: Sensor Interface ToF Companion Chip; Manufacturer: Melexis; PackageReference: AQFN-84; Mounting Technology: Surface Mount; PartNumber: MLX75123RLA-BAG-000-RE
U21 = TC358748XBG(EL): IC MIPI CSI2 TO PARALLEL 80VFBGA; Manufacturer: Toshiba Semiconductor; PartNumber: TC358748XBG(EL); Mounting Technology: Surface Mount; PackageReference: BGA-80
Y4 = KC2016K80.0000C1GE00: OSC XO 80.0000MHZ CMOS SMD; Manufacturer: AVX; PartNumber: KC2016K80.0000C1GE00; Mounting Technology: Surface Mount; PackageReference: SMD-4
Y6 = KC2016K32.0000C1GE00: OSC XO 32.0000MHZ CMOS SMD; Manufacturer: Kyocera; PartNumber: KC2016K32.0000C1GE00; Mounting Technology: Surface Mount; PackageReference: SMD-4

## Sheet PowerCommConnector.SchDoc
size A; DocumentNumber: 14; SheetNumber: 14
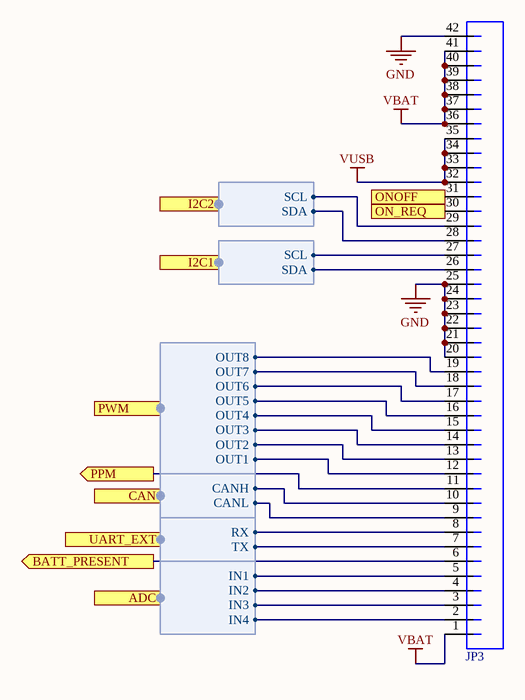
[diagram p11: PowerCommConnector.SchDoc]

### Parts
JP3  HIROSE_BM23PF_40_RECEPTACLE  [HIROSE-BM23PF-40-0.35MM-RECEPTACLE]  (value not drawn)

### Ports
ADC (harness ADC), BATT_PRESENT (out), CAN (harness CAN), I2C1 (harness I2C), I2C2 (harness I2C), ON_REQ (in), ONOFF (out), PPM (out), PWM (harness PWM), UART_EXT (harness UART)

### Harnesses
I2C: SCL, SDA
PWM: OUT8, OUT7, OUT1, OUT3, OUT2, OUT4, OUT6, OUT5
ADC: IN3, IN2, IN1, IN4
CAN: CANL, CANH
UART: TX, RX

### Nets
GND: JP3.20 JP3.21 JP3.22 JP3.23 JP3.24 JP3.25 JP3.42
VBAT: JP3.1 JP3.36 JP3.37 JP3.38 JP3.39 JP3.40 JP3.41
VUSB: JP3.32 JP3.33 JP3.34 JP3.35
I2C1_SCL: JP3.27 ; port I2C1.SCL
I2C1_SDA: JP3.26 ; port I2C1.SDA
I2C2_SCL: JP3.29 ; port I2C2.SCL
I2C2_SDA: JP3.28 ; port I2C2.SDA
UART_EXT_RX: JP3.8 ; port UART_EXT.RX
UART_EXT_TX: JP3.7 ; port UART_EXT.TX
NetJP3_2: JP3.2 ; port ADC.IN4
NetJP3_3: JP3.3 ; port ADC.IN3
NetJP3_4: JP3.4 ; port ADC.IN2
NetJP3_5: JP3.5 ; port ADC.IN1
NetJP3_6: JP3.6 ; port BATT_PRESENT
NetJP3_9: JP3.9 ; port CAN.CANL
NetJP3_10: JP3.10 ; port CAN.CANH
NetJP3_11: JP3.11 ; port PPM
NetJP3_12: JP3.12 ; port PWM.OUT1
NetJP3_13: JP3.13 ; port PWM.OUT2
NetJP3_14: JP3.14 ; port PWM.OUT3
NetJP3_15: JP3.15 ; port PWM.OUT4
NetJP3_16: JP3.16 ; port PWM.OUT5
NetJP3_17: JP3.17 ; port PWM.OUT6
NetJP3_18: JP3.18 ; port PWM.OUT7
NetJP3_19: JP3.19 ; port PWM.OUT8
NetJP3_30: JP3.30 ; port ON_REQ
NetJP3_31: JP3.31 ; port ONOFF

### Library data of the parts
JP3 = HIROSE_BM23PF_40_RECEPTACLE: CONN RCPT 0.35MM SMD 40POS; Manufacturer: Hirose; PartNumber: BM23PF0.8-40DS-0.35V(51); PackageReference: BM23PF-0.35; Mounting Technology: Surface Mount

## Sheet PWMDriver.SchDoc
size A; DocumentNumber: 12; SheetNumber: 12
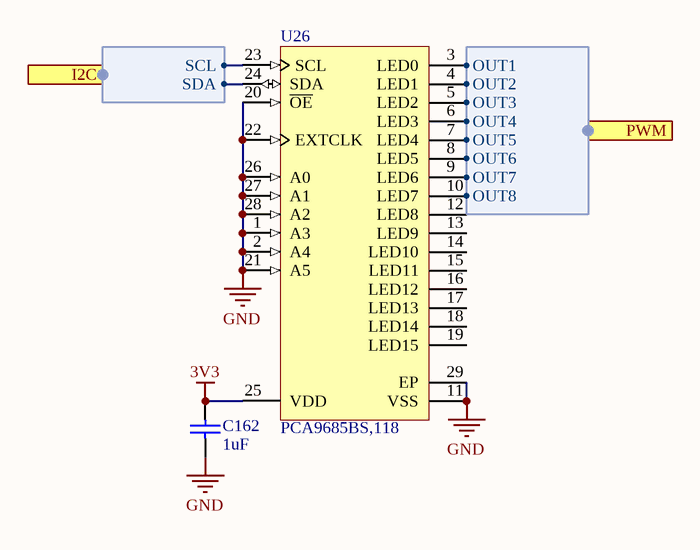
[diagram p12: PWMDriver.SchDoc]

### Parts
C162  value 1uF  [C0402[1005X55]]  (hidden comment: 1uF 6.3V 0402)
U26  PCA9685BS,118  [VQFN-28]

### Ports
I2C (harness I2C), PWM (harness PWM)

### Harnesses
I2C: SCL, SDA
PWM: OUT8, OUT7, OUT1, OUT3, OUT2, OUT4, OUT6, OUT5

### Nets
3V3: C162.2 U26.25(VDD)
GND: C162.1 U26.1(A3) U26.2(A4) U26.11(VSS) U26.20(~{OE}) U26.21(A5) U26.22(EXTCLK) U26.26(A0) U26.27(A1) U26.28(A2) U26.29(EP)
I2C2_SCL: U26.23(SCL) ; port I2C.SCL
I2C2_SDA: U26.24(SDA) ; port I2C.SDA
NetJP3_12: U26.3(LED0) ; port PWM.OUT1
NetJP3_13: U26.4(LED1) ; port PWM.OUT2
NetJP3_14: U26.5(LED2) ; port PWM.OUT3
NetJP3_15: U26.6(LED3) ; port PWM.OUT4
NetJP3_16: U26.7(LED4) ; port PWM.OUT5
NetJP3_17: U26.8(LED5) ; port PWM.OUT6
NetJP3_18: U26.9(LED6) ; port PWM.OUT7
NetJP3_19: U26.10(LED7) ; port PWM.OUT8

Not connected (* = marked no-connect by the designer): U26 12(LED8) 13(LED9) 14(LED10) 15(LED11) 16(LED12) 17(LED13) 18(LED14) 19(LED15)

### Library data of the parts
C162 = CAP_1uF_6.3V_0402_10%: as C88 on sheet Cameras; Mounting Technology: Surface Mount; PackageReference: 0402; PackageDescription: 0402 (1005 Metric); Voltage: 6.3V; Tolerance: 10%
U26 = PCA9685BS,118: IC LED DRVR LIN DIM 25MA 28HVQFN; Manufacturer: NXP; PartNumber: PCA9685BS,118; PackageReference: QFN-28; Mounting Technology: Surface Mount

## Nets that join several sheets
1V2: Supplies (C145.2 L7.2 U20.6), Cameras (7 pins)
1V4: Supplies (5 pins), MPU-Memory (64 pins), MPU-Control (R5.2)
1V8: Supplies (C63.2 D2.2 L2.2 U7.1), Cameras (10 pins)
3V3: Supplies (6 pins), MPU-Control (R4.2 SW1.1 SW1.2 U4.1), MPU-Peripherals (C158.1 U24.3), WiFi (C76.2 U9.30), Sensors (28 pins), UWB (21 pins), MicrophoneArray (12 pins), Cameras (C93.2 U14.B17), PWMDriver (C162.2 U26.25)
3V3_SLOW: Supplies (C65.1 D2.1 L3.2 U7.10), MPU-Control (U1.T9), MPU-Peripherals (30 pins), WiFi (C74.1 U9.36), USB (6 pins), Cameras (27 pins)
GND: Supplies (47 pins), MPU-Memory (72 pins), MPU-Control (15 pins), MPU-Peripherals (15 pins), WiFi (18 pins), USB (17 pins), Sensors (35 pins), UWB (36 pins), MicrophoneArray (9 pins), Cameras (76 pins), PowerCommConnector (7 pins), PWMDriver (11 pins)
MIXH: Supplies (C157.2 L9.2 U23.3), Cameras (JP2.59 JP2.60)
VBAT: Supplies (9 pins), Cameras (JP2.58), PowerCommConnector (7 pins)
VLED: Supplies (5 pins), Cameras (8 pins)
VMUX: Supplies (15 pins), MPU-Peripherals (LS1.1)
VUSB: Supplies (U13.6), MPU-Peripherals (C32.2 U1.W20), USB (C77.1 JP1.1 R30.2 U10.4), PowerCommConnector (JP3.32 JP3.33 JP3.34 JP3.35)
CSI1_D0: MPU-Peripherals (U1.M20), Cameras (U21.J3)
CSI1_D1: MPU-Peripherals (U1.H20), Cameras (U21.K3)
CSI1_D2: MPU-Peripherals (U1.H16), Cameras (U21.J2)
CSI1_D3: MPU-Peripherals (U1.K17), Cameras (U21.K2)
CSI1_D4: MPU-Peripherals (U1.K16), Cameras (U21.J1)
CSI1_D5: MPU-Peripherals (U1.K15), Cameras (U21.K1)
CSI1_D6: MPU-Peripherals (U1.L16), Cameras (U21.G2)
CSI1_D7: MPU-Peripherals (U1.K19), Cameras (U21.G1)
CSI1_D8: MPU-Peripherals (U1.L15), Cameras (U21.F2)
CSI1_D9: MPU-Peripherals (U1.K18), Cameras (U21.F1)
CSI1_D10: MPU-Peripherals (U1.G16), Cameras (U21.E2)
CSI1_D11: MPU-Peripherals (U1.G19), Cameras (U21.E1)
CSI1_HSYNC: MPU-Peripherals (U1.M15), Cameras (U21.J7)
CSI1_PIXCLK: MPU-Peripherals (U1.M16), Cameras (U21.K7)
CSI1_VSYNC: MPU-Peripherals (U1.N19), Cameras (U21.J6)
CSI2_D0: MPU-Peripherals (U1.D10), Cameras (U14.A30)
CSI2_D1: MPU-Peripherals (U1.B8), Cameras (U14.B27)
CSI2_D2: MPU-Peripherals (U1.C11), Cameras (U14.A29)
CSI2_D3: MPU-Peripherals (U1.A9), Cameras (U14.B26)
CSI2_D4: MPU-Peripherals (U1.A11), Cameras (U14.A28)
CSI2_D5: MPU-Peripherals (U1.D11), Cameras (U14.B25)
CSI2_D6: MPU-Peripherals (U1.B9), Cameras (U14.A27)
CSI2_D7: MPU-Peripherals (U1.A12), Cameras (U14.B24)
CSI2_D8: MPU-Peripherals (U1.A10), Cameras (U14.A26)
CSI2_D9: MPU-Peripherals (U1.C12), Cameras (U14.B23)
CSI2_D10: MPU-Peripherals (U1.E8), Cameras (U14.A25)
CSI2_D11: MPU-Peripherals (U1.A7), Cameras (U14.B22)
CSI2_HSYNC: MPU-Peripherals (U1.B12), Cameras (U14.B29)
CSI2_PIXCLK: MPU-Peripherals (U1.B11), Cameras (U14.B28)
CSI2_VSYNC: MPU-Peripherals (U1.B10), Cameras (U14.A31)
I2C1_SCL: MPU-Peripherals (R20.1 U1.B20), Sensors (U19.1), Cameras (JP2.48 U14.A12 U21.A8), PowerCommConnector (JP3.27)
I2C1_SDA: MPU-Peripherals (R21.1 U1.D19), Sensors (U19.6), Cameras (JP2.49 U14.B11 U21.B8), PowerCommConnector (JP3.26)
I2C2_SCL: MPU-Peripherals (R36.1 U1.D13), Sensors (5 pins), PowerCommConnector (JP3.29), PWMDriver (U26.23)
I2C2_SDA: MPU-Peripherals (R35.1 U1.C13), Sensors (5 pins), PowerCommConnector (JP3.28), PWMDriver (U26.24)
NetJP3_2: Sensors (U25.4), PowerCommConnector (JP3.2)
NetJP3_3: Sensors (U25.5), PowerCommConnector (JP3.3)
NetJP3_4: Sensors (U25.8), PowerCommConnector (JP3.4)
NetJP3_5: Sensors (U25.9), PowerCommConnector (JP3.5)
NetJP3_6: Supplies (R39.1 U13.3), PowerCommConnector (JP3.6)
NetJP3_9: MPU-Peripherals (R45.1 U24.6), PowerCommConnector (JP3.9)
NetJP3_10: MPU-Peripherals (R45.2 U24.7), PowerCommConnector (JP3.10)
NetJP3_11: MPU-Peripherals (U1.A5), PowerCommConnector (JP3.11)
NetJP3_12: PowerCommConnector (JP3.12), PWMDriver (U26.3)
NetJP3_13: PowerCommConnector (JP3.13), PWMDriver (U26.4)
NetJP3_14: PowerCommConnector (JP3.14), PWMDriver (U26.5)
NetJP3_15: PowerCommConnector (JP3.15), PWMDriver (U26.6)
NetJP3_16: PowerCommConnector (JP3.16), PWMDriver (U26.7)
NetJP3_17: PowerCommConnector (JP3.17), PWMDriver (U26.8)
NetJP3_18: PowerCommConnector (JP3.18), PWMDriver (U26.9)
NetJP3_19: PowerCommConnector (JP3.19), PWMDriver (U26.10)
NetJP3_30: MPU-Control (U1.P15), PowerCommConnector (JP3.30)
NetJP3_31: MPU-Control (U1.U16), PowerCommConnector (JP3.31)
NetR14_1: MPU-Peripherals (R14.1 U1.F12), WiFi (U9.22)
NetR15_1: MPU-Peripherals (R15.1 U1.E13), WiFi (U9.24)
NetR16_1: MPU-Peripherals (R16.1 U1.E14), WiFi (U9.26)
NetR17_1: MPU-Peripherals (R17.1 U1.F10), WiFi (U9.23)
NetR18_1: MPU-Peripherals (R18.1 U1.F11), WiFi (U9.25)
NetR19_2: MPU-Peripherals (R19.2), WiFi (U9.20)
NetR38_1: Supplies (U13.1), MPU-Peripherals (R38.1 U1.A17)
NetU1_A16: MPU-Peripherals (U1.A16), UWB (U12.45)
NetU7_9: Supplies (U7.9), Cameras (U14.A19)
PWR_GOOD: Supplies (U7.8), MPU-Control (SW2.2 U4.4)
RESET: MPU-Control (C5.2 R4.1 U1.R16 U4.6), USB (U10.2 U11.15), Cameras (JP2.57 U14.A14 U21.B9)
SPI_CS: MPU-Peripherals (U1.C14), UWB (U12.24)
SPI_MISO: MPU-Peripherals (U1.A14), UWB (U12.40)
SPI_MOSI: MPU-Peripherals (U1.A15), UWB (U12.39)
SPI_SCLK: MPU-Peripherals (U1.B14), UWB (U12.41)
TDM_SCK: MPU-Peripherals (U1.V6), MicrophoneArray (MK1.6 MK2.6 MK3.6 MK4.6)
TDM_SD: MPU-Peripherals (U1.T7), MicrophoneArray (5 pins)
TDM_WS: MPU-Peripherals (U1.W8), MicrophoneArray (MK1.5)
TRIGGER: MPU-Peripherals (U1.D18), Sensors (U15.11), Cameras (JP2.56 U14.A13)
UART_EXT_RX: MPU-Peripherals (U1.Y8), PowerCommConnector (JP3.8)
UART_EXT_TX: MPU-Peripherals (U1.T6), PowerCommConnector (JP3.7)
UART_USB_RX: MPU-Peripherals (U1.B18), USB (U10.7)
UART_USB_TX: MPU-Peripherals (U1.E16), USB (U10.10)
USB_OTG_N: MPU-Peripherals (U1.V19), USB (U11.2)
USB_OTG_P: MPU-Peripherals (U1.V20), USB (U11.3)